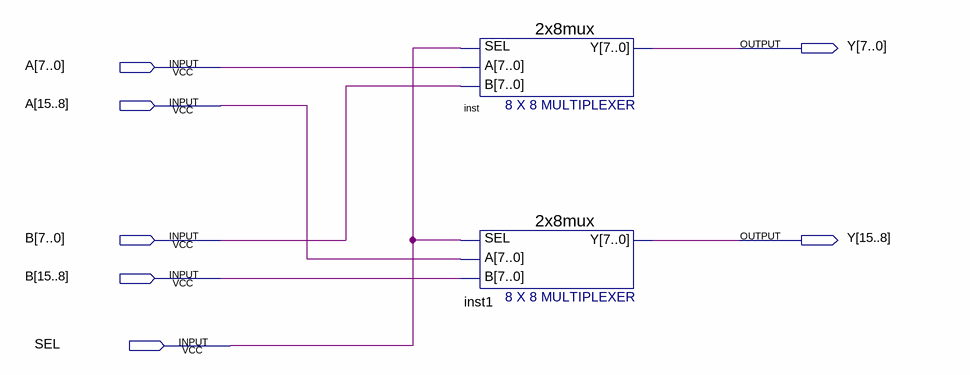
[diagram p0: schematic sheet]
// Quartus schematic 16b_mux.bdf as structural Verilog: 2 symbols, 7 pins
module \16b_mux  (
  input  [15:0] A,
  input  [15:0] B,
  input  SEL,
  output [15:0] Y
);

  \2x8mux  inst (.SEL(SEL), .A(A[7:0]), .B(B[7:0]), .Y(Y[7:0]));
  \2x8mux  inst1 (.SEL(SEL), .A(A[15:8]), .B(B[15:8]), .Y(Y[15:8]));
endmodule
